# EAGLE schematic box (EAGLE 8.7.0)
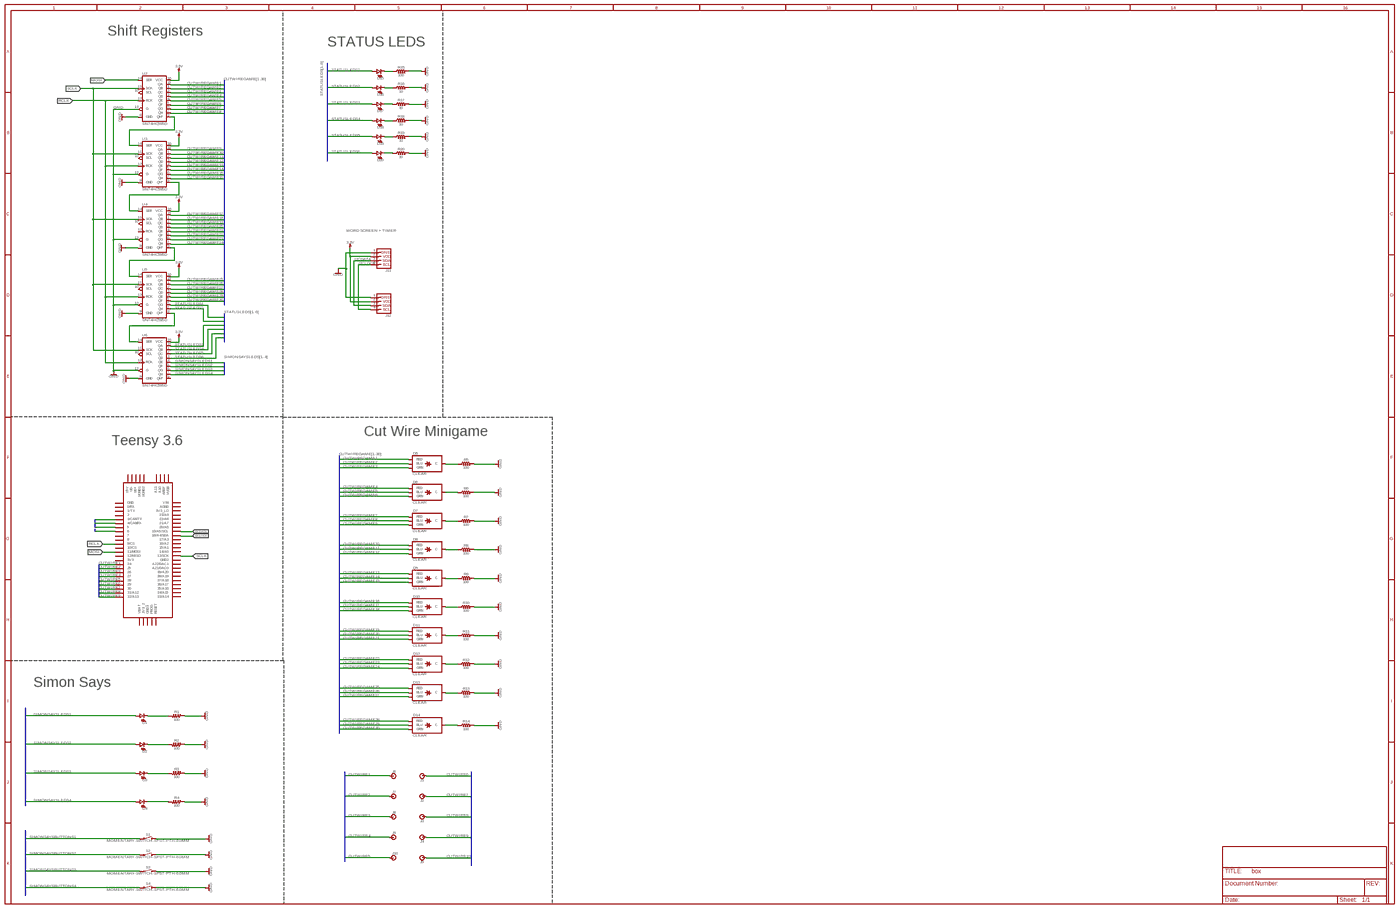
[diagram p0: schematic, sheet 1, overview]
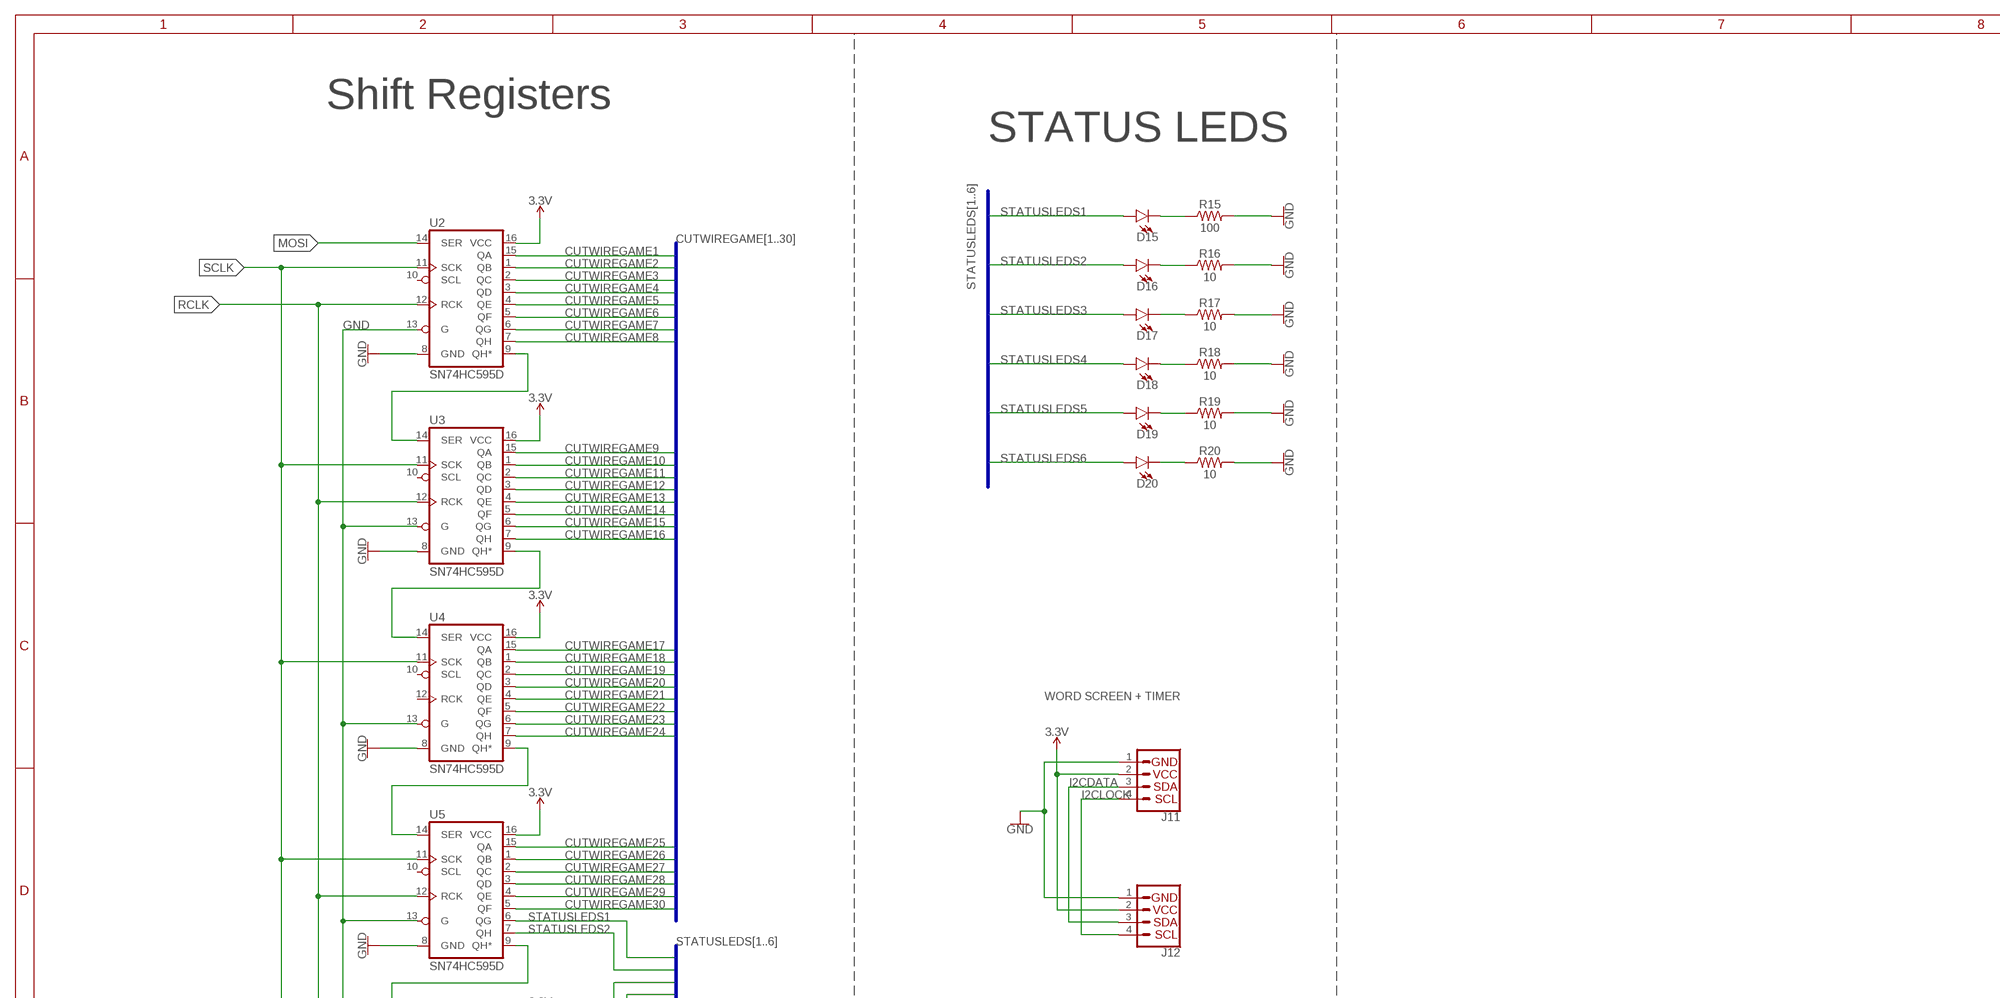
[diagram p1: schematic, sheet 1, part 1 of 4]
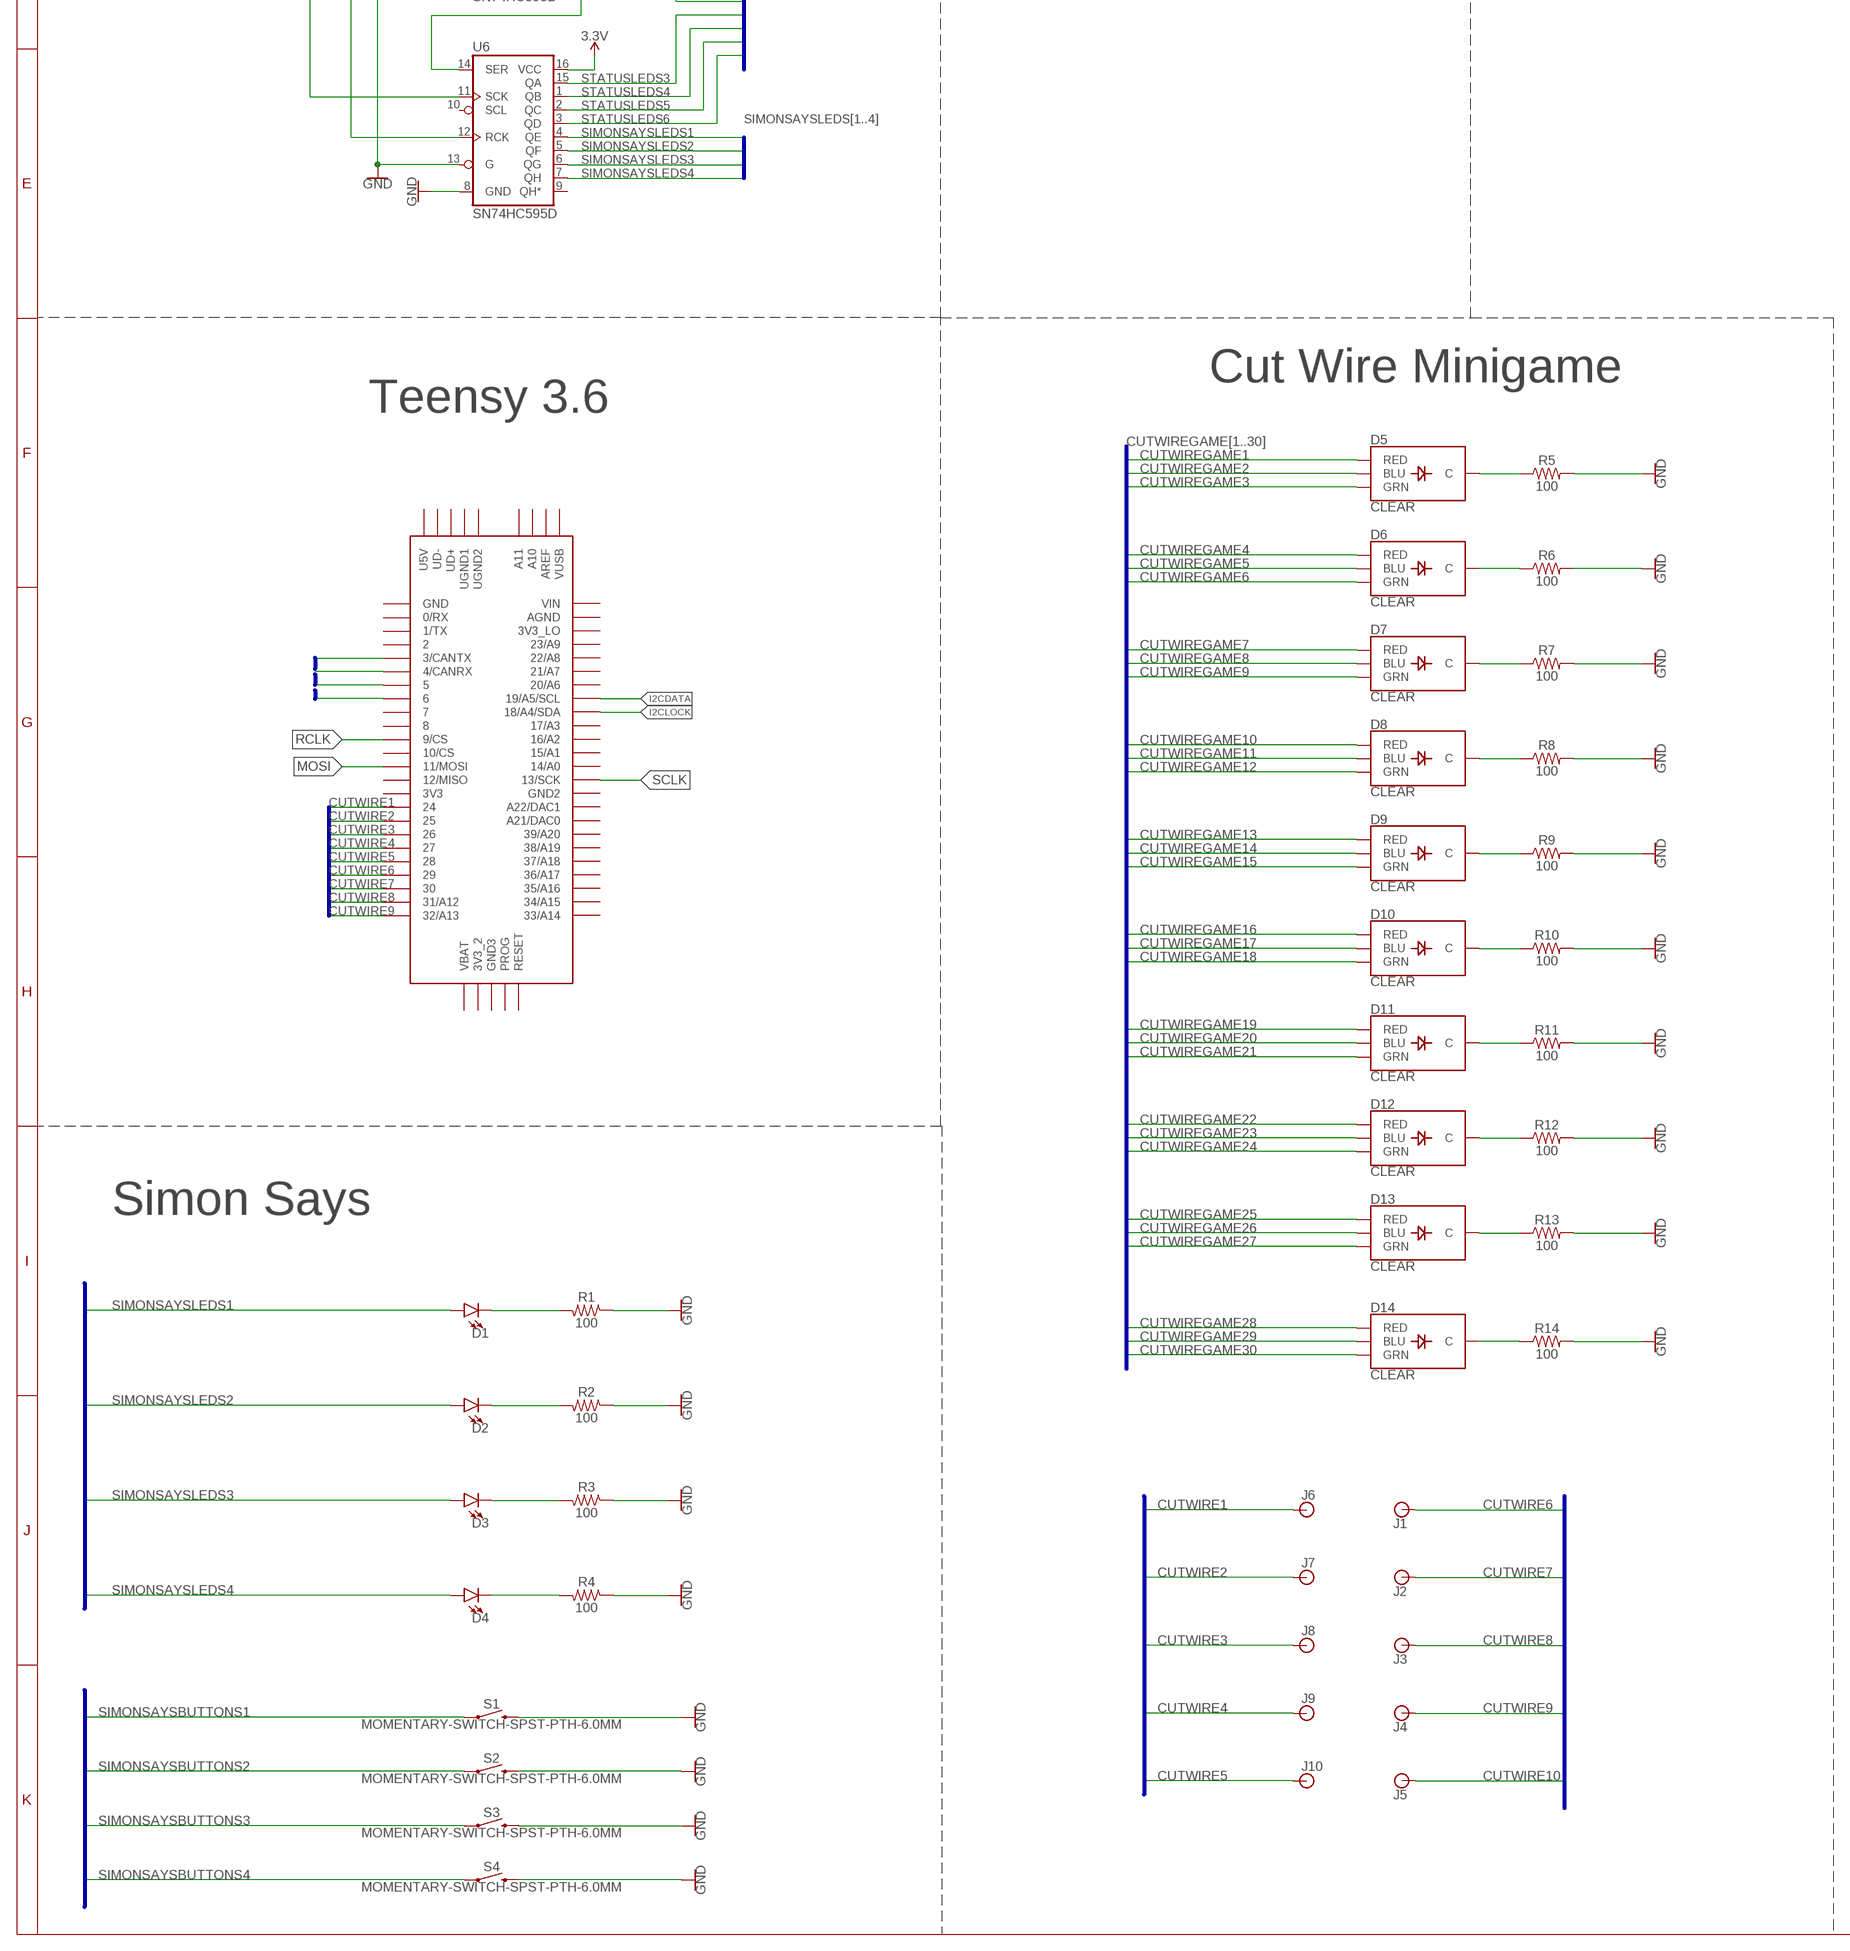
[diagram p2: schematic, sheet 1, part 2 of 4]
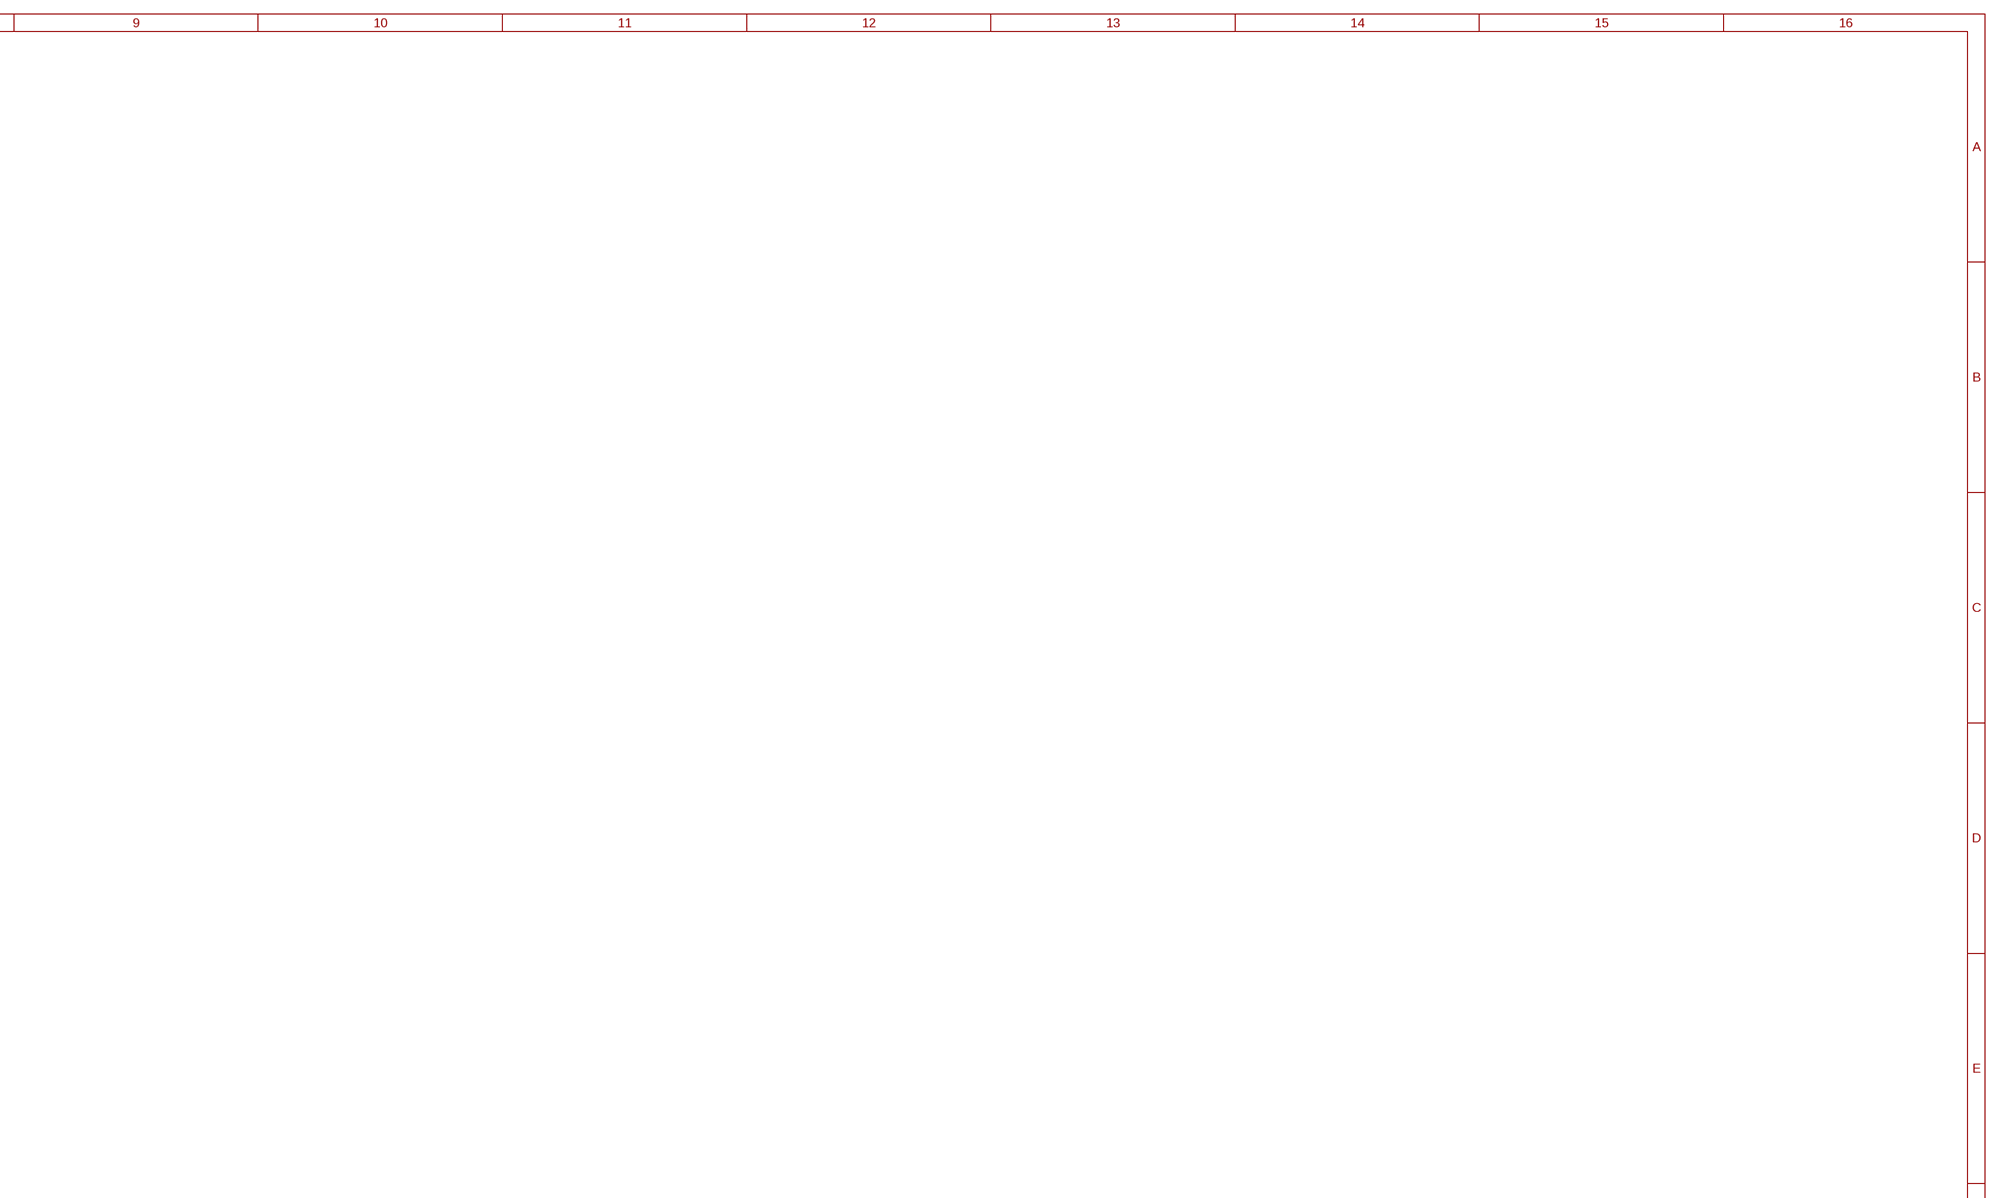
[diagram p3: schematic, sheet 1, part 3 of 4]
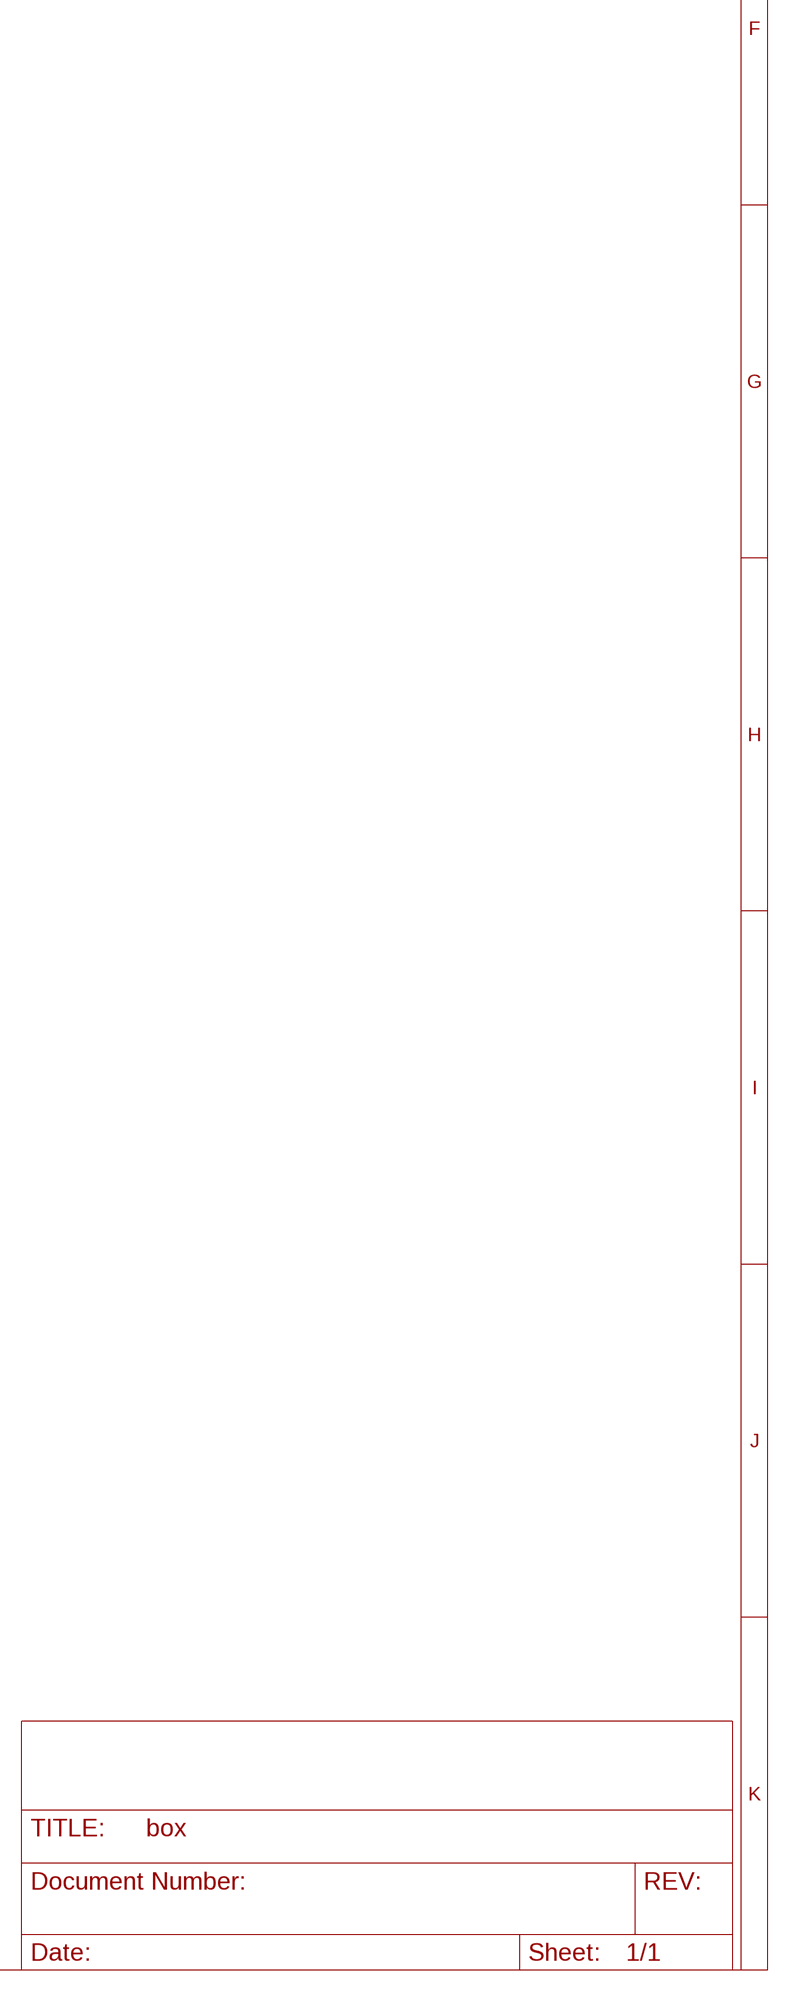
[diagram p4: schematic, sheet 1, part 4 of 4]

## Parts
D1  LED3MM  [LED_3MM]
D2  LED3MM  [LED_3MM]
D3  LED3MM  [LED_3MM]
D4  LED3MM  [LED_3MM]
D5  CLEAR  LED-RGB-CCCLEAR  [LED-RGB-THRU]
D6  CLEAR  LED-RGB-CCCLEAR  [LED-RGB-THRU]
D7  CLEAR  LED-RGB-CCCLEAR  [LED-RGB-THRU]
D8  CLEAR  LED-RGB-CCCLEAR  [LED-RGB-THRU]
D9  CLEAR  LED-RGB-CCCLEAR  [LED-RGB-THRU]
D10  CLEAR  LED-RGB-CCCLEAR  [LED-RGB-THRU]
D11  CLEAR  LED-RGB-CCCLEAR  [LED-RGB-THRU]
D12  CLEAR  LED-RGB-CCCLEAR  [LED-RGB-THRU]
D13  CLEAR  LED-RGB-CCCLEAR  [LED-RGB-THRU]
D14  CLEAR  LED-RGB-CCCLEAR  [LED-RGB-THRU]
D15  LED5MM  [LED_5MM]
D16  LED5MM  [LED_5MM]
D17  LED5MM  [LED_5MM]
D18  LED5MM  [LED_5MM]
D19  LED5MM  [LED_5MM]
D20  LED5MM  [LED_5MM]
J1  BANANA_CONN  [BANANA_CONN]
J2  BANANA_CONN  [BANANA_CONN]
J3  BANANA_CONN  [BANANA_CONN]
J4  BANANA_CONN  [BANANA_CONN]
J5  BANANA_CONN  [BANANA_CONN]
J6  BANANA_CONN  [BANANA_CONN]
J7  BANANA_CONN  [BANANA_CONN]
J8  BANANA_CONN  [BANANA_CONN]
J9  BANANA_CONN  [BANANA_CONN]
J10  BANANA_CONN  [BANANA_CONN]
J11  I2C_STANDARD  [1X04]
J12  I2C_STANDARD  [1X04]
R1  100  100OHM-HORIZ_KIT-1/4W-1%  [AXIAL-0.3EZ]
R2  100  100OHM-HORIZ_KIT-1/4W-1%  [AXIAL-0.3EZ]
R3  100  100OHM-HORIZ_KIT-1/4W-1%  [AXIAL-0.3EZ]
R4  100  100OHM-HORIZ_KIT-1/4W-1%  [AXIAL-0.3EZ]
R5  100  100OHM-HORIZ-1/4W-1%  [AXIAL-0.3]
R6  100  100OHM-HORIZ-1/4W-1%  [AXIAL-0.3]
R7  100  100OHM-HORIZ-1/4W-1%  [AXIAL-0.3]
R8  100  100OHM-HORIZ-1/4W-1%  [AXIAL-0.3]
R9  100  100OHM-HORIZ-1/4W-1%  [AXIAL-0.3]
R10  100  100OHM-HORIZ-1/4W-1%  [AXIAL-0.3]
R11  100  100OHM-HORIZ-1/4W-1%  [AXIAL-0.3]
R12  100  100OHM-HORIZ-1/4W-1%  [AXIAL-0.3]
R13  100  100OHM-HORIZ-1/4W-1%  [AXIAL-0.3]
R14  100  100OHM-HORIZ-1/4W-1%  [AXIAL-0.3]
R15  100  100OHM-HORIZ-1/4W-1%  [AXIAL-0.3]
R16  10  10OHM-HORIZ-1/4W-1%  [AXIAL-0.3]
R17  10  10OHM-HORIZ-1/4W-1%  [AXIAL-0.3]
R18  10  10OHM-HORIZ-1/4W-1%  [AXIAL-0.3]
R19  10  10OHM-HORIZ-1/4W-1%  [AXIAL-0.3]
R20  10  10OHM-HORIZ-1/4W-1%  [AXIAL-0.3]
S1  MOMENTARY-SWITCH-SPST-PTH-6.0MM  [TACTILE_SWITCH_PTH_6.0MM]
S2  MOMENTARY-SWITCH-SPST-PTH-6.0MM  [TACTILE_SWITCH_PTH_6.0MM]
S3  MOMENTARY-SWITCH-SPST-PTH-6.0MM  [TACTILE_SWITCH_PTH_6.0MM]
S4  MOMENTARY-SWITCH-SPST-PTH-6.0MM  [TACTILE_SWITCH_PTH_6.0MM]
U2  SN74HC595D  74HC595D  [SO16]
U3  SN74HC595D  74HC595D  [SO16]
U4  SN74HC595D  74HC595D  [SO16]
U5  SN74HC595D  74HC595D  [SO16]
U6  SN74HC595D  74HC595D  [SO16]
U$1  TEENSY_3.5/3.6  [TEENSY_3.5/3.6]

## Nets
3.3V: J11.2 J12.2 U2.16(VCC) U3.16(VCC) U4.16(VCC) U5.16(VCC) U6.16(VCC)
CUTWIRE1: J6.P$1 U$1.24
CUTWIRE2: J7.P$1 U$1.25
CUTWIRE3: J8.P$1 U$1.26
CUTWIRE4: J9.P$1 U$1.27
CUTWIRE5: J10.P$1 U$1.28
CUTWIRE6: J1.P$1 U$1.29
CUTWIRE7: J2.P$1 U$1.30
CUTWIRE8: J3.P$1 U$1.31/A12
CUTWIRE9: J4.P$1 U$1.32/A13
CUTWIRE10: J5.P$1
CUTWIREGAME1: D5.1(RED) U2.15(QA)
CUTWIREGAME2: D5.4(BLU) U2.1(QB)
CUTWIREGAME3: D5.3(GRN) U2.2(QC)
CUTWIREGAME4: D6.1(RED) U2.3(QD)
CUTWIREGAME5: D6.4(BLU) U2.4(QE)
CUTWIREGAME6: D6.3(GRN) U2.5(QF)
CUTWIREGAME7: D7.1(RED) U2.6(QG)
CUTWIREGAME8: D7.4(BLU) U2.7(QH)
CUTWIREGAME9: D7.3(GRN) U3.15(QA)
CUTWIREGAME10: D8.1(RED) U3.1(QB)
CUTWIREGAME11: D8.4(BLU) U3.2(QC)
CUTWIREGAME12: D8.3(GRN) U3.3(QD)
CUTWIREGAME13: D9.1(RED) U3.4(QE)
CUTWIREGAME14: D9.4(BLU) U3.5(QF)
CUTWIREGAME15: D9.3(GRN) U3.6(QG)
CUTWIREGAME16: D10.1(RED) U3.7(QH)
CUTWIREGAME17: D10.4(BLU) U4.15(QA)
CUTWIREGAME18: D10.3(GRN) U4.1(QB)
CUTWIREGAME19: D11.1(RED) U4.2(QC)
CUTWIREGAME20: D11.4(BLU) U4.3(QD)
CUTWIREGAME21: D11.3(GRN) U4.4(QE)
CUTWIREGAME22: D12.1(RED) U4.5(QF)
CUTWIREGAME23: D12.4(BLU) U4.6(QG)
CUTWIREGAME24: D12.3(GRN) U4.7(QH)
CUTWIREGAME25: D13.1(RED) U5.15(QA)
CUTWIREGAME26: D13.4(BLU) U5.1(QB)
CUTWIREGAME27: D13.3(GRN) U5.2(QC)
CUTWIREGAME28: D14.1(RED) U5.3(QD)
CUTWIREGAME29: D14.4(BLU) U5.4(QE)
CUTWIREGAME30: D14.3(GRN) U5.5(QF)
GND: J11.1 J12.1 R1.P$1 R2.P$1 R3.P$1 R4.P$1 R5.P$2 R6.P$2 R7.P$2 R8.P$2 R9.P$2 R10.P$2 R11.P$2 R12.P$2 R13.P$2 R14.P$2 R15.P$2 R16.P$2 R17.P$2 R18.P$2 R19.P$2 R20.P$2 S1.3 S2.3 S3.3 S4.3 U2.8(GND) U2.13(G) U3.8(GND) U3.13(G) U4.8(GND) U4.13(G) U5.8(GND) U5.13(G) U6.8(GND) U6.13(G)
I2CDATA: J11.3 J12.3 U$1.19/A5/SCL
I2CLOCK: J11.4 J12.4 U$1.18/A4/SDA
MOSI: U2.14(SER) U$1.11/MOSI
N$1: D4.K(C) R4.P$2
N$2: D3.K(C) R3.P$2
N$3: D2.K(C) R2.P$2
N$4: D1.K(C) R1.P$2
N$5: U5.9(QH*) U6.14(SER)
N$6: U4.9(QH*) U5.14(SER)
N$7: U3.9(QH*) U4.14(SER)
N$8: U2.9(QH*) U3.14(SER)
N$9: D20.K(C) R20.P$1
N$10: D19.K(C) R19.P$1
N$11: D18.K(C) R18.P$1
N$12: D16.K(C) R16.P$1
N$13: D15.K(C) R15.P$1
N$14: D17.K(C) R17.P$1
N$37: D14.2(C) R14.P$1
N$38: D13.2(C) R13.P$1
N$39: D12.2(C) R12.P$1
N$40: D11.2(C) R11.P$1
N$41: D10.2(C) R10.P$1
N$42: D9.2(C) R9.P$1
N$43: D8.2(C) R8.P$1
N$44: D7.2(C) R7.P$1
N$45: D6.2(C) R6.P$1
N$46: D5.2(C) R5.P$1
RCLK: U2.12(RCK) U3.12(RCK) U5.12(RCK) U6.12(RCK) U$1.9/CS
SCLK: U2.11(SCK) U3.11(SCK) U4.11(SCK) U5.11(SCK) U6.11(SCK) U$1.13/SCK
SIMONSAYSBUTTONS1: S1.1 U$1.3/CANTX
SIMONSAYSBUTTONS2: S2.1 U$1.4/CANRX
SIMONSAYSBUTTONS3: S3.1 U$1.5
SIMONSAYSBUTTONS4: S4.1 U$1.6
SIMONSAYSLEDS1: D1.A U6.4(QE)
SIMONSAYSLEDS2: D2.A U6.5(QF)
SIMONSAYSLEDS3: D3.A U6.6(QG)
SIMONSAYSLEDS4: D4.A U6.7(QH)
STATUSLEDS1: D15.A U5.6(QG)
STATUSLEDS2: D16.A U5.7(QH)
STATUSLEDS3: D17.A U6.15(QA)
STATUSLEDS4: D18.A U6.1(QB)
STATUSLEDS5: D19.A U6.2(QC)
STATUSLEDS6: D20.A U6.3(QD)
Unconnected: U2.10(SCL) U3.10(SCL) U4.10(SCL) U4.12(RCK) U5.10(SCL) U6.9(QH*) U6.10(SCL) U$1.0/RX U$1.1/TX U$1.2 U$1.3V3 U$1.3V3_2 U$1.3V3_LO U$1.7 U$1.8 U$1.10/CS U$1.12/MISO U$1.14/A0 U$1.15/A1 U$1.16/A2 U$1.17/A3 U$1.20/A6 U$1.21/A7 U$1.21/DAC0(A21/DAC0) U$1.22/A8 U$1.23/A9 U$1.33/A14 U$1.34/A15 U$1.35/A16 U$1.36/A17 U$1.37/A18 U$1.38/A19 U$1.39/A20 U$1.A10 U$1.A11 U$1.A22/DAC1 U$1.AGND U$1.AREF U$1.GND U$1.GND2 U$1.GND3 U$1.PROG U$1.RESET U$1.U5V U$1.UD+ U$1.UD- U$1.UGND1 U$1.UGND2 U$1.VBAT U$1.VIN U$1.VUSB

## Buses
CUTWIREGAME[1..30]
CUTWIRE[1..5]
CUTWIRE[6..10]
SIMONSAYSLEDS[1..4]
SIMONSAYSBUTTONS[1..4]
STATUSLEDS[1..6]
CUTWIRE[1..10]

## Notes on the sheet
- Shift Registers
- STATUS LEDS
- WORD SCREEN + TIMER
- Teensy 3.6 | Cut Wire Minigame
- Simon Says

## Library data of the parts
D1-D4 = SparkFun-LED:LED: LED (Generic) Standard schematic elements and footprints for 5mm, 3mm, 1206, and 0603 sized LEDs. Generic LEDs with no color specified.; PROD_ID: DIO-08794
D5-D14 = SparkFun-LED:LED-RGB-CC: LED-RGB Common Cathode Packages: LED RGB-THRU LED_PIRANHA_5MM SparkFun Products: RGB Diffused Common Cathode- Diffuse <[https://www.sparkfun.com/products/9264]> RGB Diffused Common Cathode - Clear <[https://www.sparkfun.com/products/105]> LED-RGB 5mm Square (Piranha) <[https://www.sparkfun.com/products/11679]>; PROD_ID: DIO-08418
D15-D20 = SparkFun-LED:LED: LED (Generic) Standard schematic elements and footprints for 5mm, 3mm, 1206, and 0603 sized LEDs. Generic LEDs with no color specified.
J1-J10 = SparkFun-Connectors:BANANA_CONN: Through-hole Banana Jack Basic PTH connection for banana jack plugs SparkFun Products: Multimeter Kit <https://www.sparkfun.com/products/retired/10956> Banana to Alligator Cable <https://www.sparkfun.com/products/retired/509> Banana to Alligator Coax Cable <https://www.sparkfun.com/products/retired/508> Banana to Banana Cable <https://www.sparkfun.com/products/retired/507> Banana to IC Hook Cables <https://www.sparkfun.com/products/retired/506>
J11 J12 = SparkFun-Connectors:I2C_STANDARD: SparkFun I2C Standard Pinout Header SparkFun has standardized on a pinout for all I2C based sensor breakouts. This pinout allows I2C boards to be plugged directly into the headers on Arduino Uno compatible boards, and to be daisy chained easily. Example SparkFun Products: SparkFun Atmospheric Sensor Breakout - BME280 <https://www.sparkfun.com/products/13676> SparkFun Altitude/Pressure Sensor Breakout - MPL3115A2 <https://www.sparkfun.com/products/11084> SparkFun TOF Range Finder Sensor - VL6180 <https://www.sparkfun.com/products/12785>
R1-R15 = SparkFun-Resistors:100OHM: 100Ω resistor A resistor is a passive two-terminal electrical component that implements electrical resistance as a circuit element. Resistors act to reduce current flow, and, at the same time, act to lower voltage levels within circuits. - Wikipedia; PROD_ID: RES-12181
R16-R20 = SparkFun-Resistors:10OHM: 10Ω resistor A resistor is a passive two-terminal electrical component that implements electrical resistance as a circuit element. Resistors act to reduce current flow, and, at the same time, act to lower voltage levels within circuits. - Wikipedia; PROD_ID: RES-12180
S1-S4 = SparkFun-Switches:MOMENTARY-SWITCH-SPST: Momentary Switch (Pushbutton) - SPST Normally-open (NO) SPST momentary switches (buttons, pushbuttons). Variants PTH-12MM - 12mm square, through-hole Momentary Pushbutton Switch - 12mm Square <https://www.sparkfun.com/products/9190> (COM-09190) PTH-6.0MM, PTH-6.0MM-KIT - 6.0mm square, through-hole Mini Pushbutton Switch <https://www.sparkfun.com/products/97> (COM-00097) KIT package intended for soldering kit's - only one side of pads' copper is exposed. PTH-RIGHT-ANGLE-KIT - Right-angle, through-hole Right Angle Tactile Button <https://www.sparkfun.com/products/10791> - Used on SparkFun BigTime Watch Kit <https://www.sparkfun.com/products/11734> SMD-12MM - 12mm square, surface-mount Tactile Button - SMD (12mm) <https://www.sparkfun.com/products/12993> (COM-12993) Used on SparkFun PicoBoard <https://www.sparkfun.com/products/11888> SMD-4.5MM - 4.5mm Square Trackball Switch Used on SparkFun Blackberry Trackballer Breakout <https://www.sparkfun.com/products/13169> SMD-4.6MMX2.8MM - 4.60mm x 2.80mm, surface mount Used on SparkFun SAMD21 Mini Breakout <https://www.sparkfun.com/products/13664> SMD-5.2MM, SMD-5.2-REDUNDANT - 5.2mm square, surface-mount Mini Pushbutton Switch - SMD <https://www.sparkfun.com/products/8720> (COM-08720) Used on Arduino Pro Mini <https://www.sparkfun.com/products/11114> REDUNDANT package connects both switch circuits together SMD-6.0X3.5MM - 6.0 x 3.5mm, surface mount Momentary Reset Switch SMD <https://www.sparkfun.com/products/8229> (COM-08229) SMD-6.2MM-TALL - 6.2mm square, surface mount Tactile Button - SMD (6mm) <https://www.sparkfun.com/products/12992> Used on SparkFun Digital Sandbox <https://www.sparkfun.com/products/12651> SMD-RIGHT-ANGLE - Right-angle, surface mount Used on SparkFun Block for Intel® Edison - Arduino <https://www.sparkfun.com/products/13036>; PROD_ID: SWCH-08441; SF_SKU: COM-00097
U2-U6 = SparkFun-IC-Logic:74*595: 8-Bit Shift Register (Serial to Parallel) Datasheet <http://cdn.sparkfun.com/datasheets/BreakoutBoards/MM74HC595.pdf> SparkFun Products SparkFun Shift Register Breakout - 74HC595 <https://www.sparkfun.com/products/10680> (BOB-10680); PROD_ID: IC-07875
U$1 = Teensy356:TEENSY_3.5/3.6